# Altium schematic sheet 2.AD8220.SCHDOC
size A4
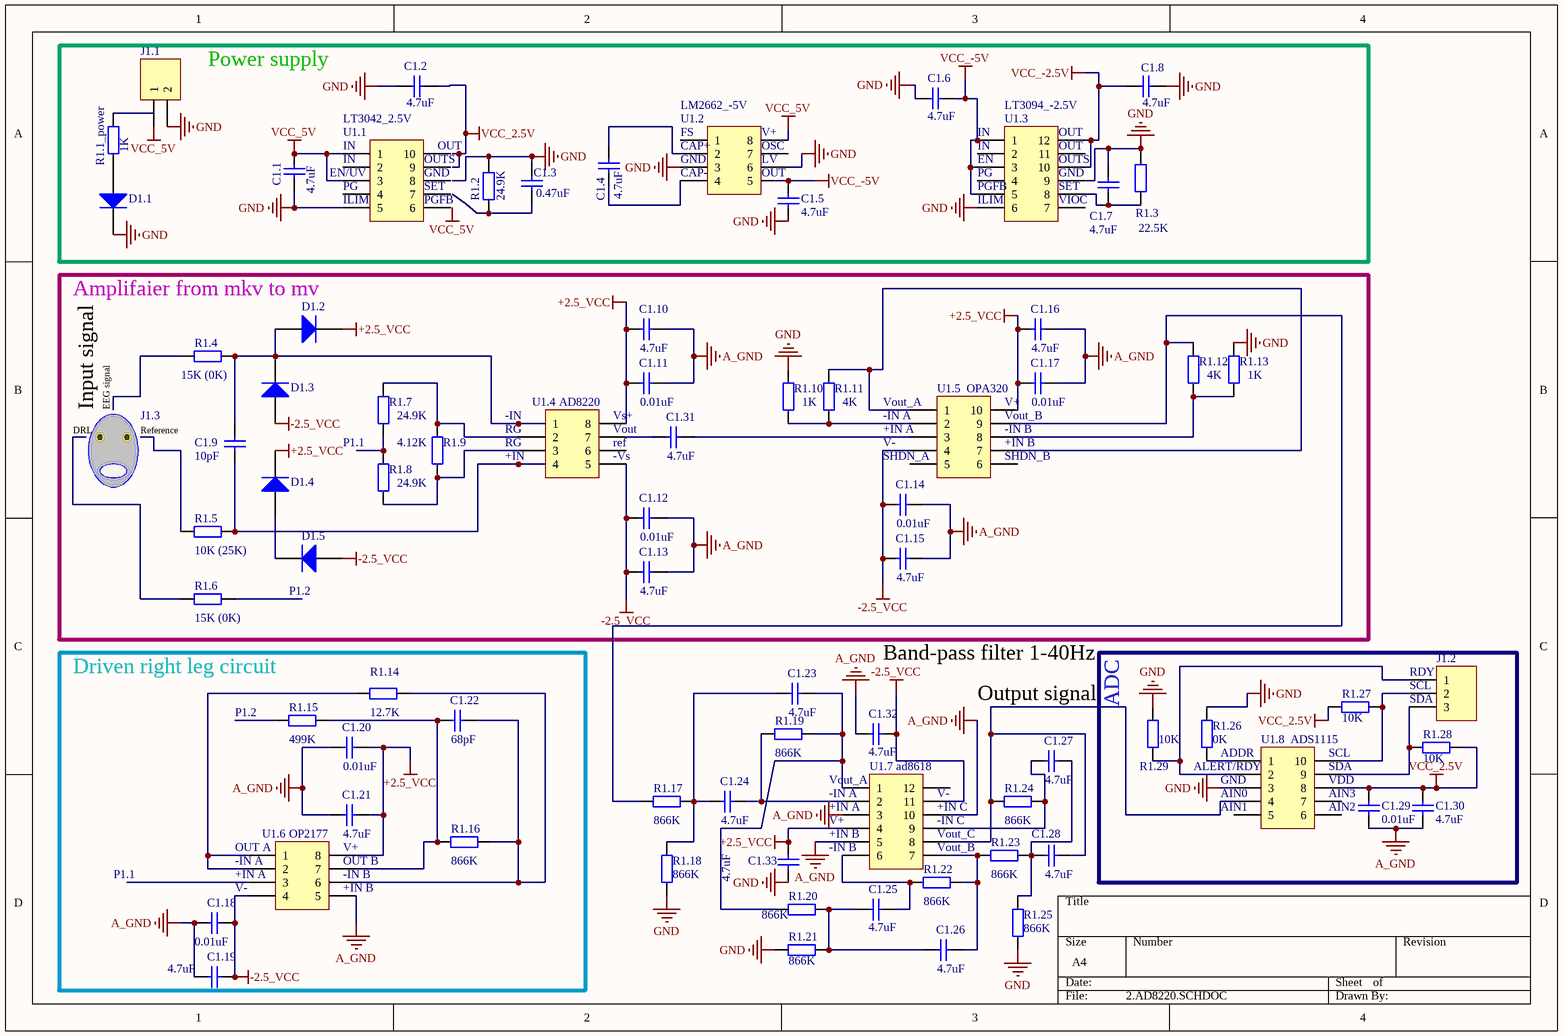
[diagram p0: 2.AD8220.SCHDOC]

## Parts
C1.1  4.7uF  [RAD-0.3]
C1.2  4.7uF  [RAD-0.3]
C1.3  0.47uF  [RAD-0.3]
C1.4  4.7uF  [RAD-0.3]
C1.5  4.7uF  [RAD-0.3]
C1.6  4.7uF  [RAD-0.3]
C1.7  4.7uF  [RAD-0.3]
C1.8  4.7uF  [RAD-0.3]
C1.9  value 10pF  [RAD-0.3]
C1.10  value 4.7uF  [RAD-0.3]
C1.11  value 0.01uF  [RAD-0.3]
C1.12  value 0.01uF  [RAD-0.3]
C1.13  value 4.7uF  [RAD-0.3]
C1.14  value 0.01uF  [RAD-0.3]
C1.15  value 4.7uF  [RAD-0.3]
C1.16  value 4.7uF  [RAD-0.3]
C1.17  value 0.01uF  [RAD-0.3]
C1.18  value 0.01uF  [RAD-0.3]
C1.19  value 4.7uF  [RAD-0.3]
C1.20  value 0.01uF  [RAD-0.3]
C1.21  value 4.7uF  [RAD-0.3]
C1.22  value 68pF  [RAD-0.3]
C1.23  value 4.7uF  [RAD-0.3]
C1.24  value 4.7uF  [RAD-0.3]
C1.25  value 4.7uF  [RAD-0.3]
C1.26  value 4.7uF  [RAD-0.3]
C1.27  value 4.7uF  [RAD-0.3]
C1.28  value 4.7uF  [RAD-0.3]
C1.29  value 0.01uF  [RAD-0.3]
C1.30  value 4.7uF  [RAD-0.3]
C1.31  value 4.7uF  [RAD-0.3]
C1.32  value 4.7uF  [RAD-0.3]
C1.33  value 4.7uF  [RAD-0.3]
D1.1  (no value)  [DO-35]
D1.2  (no value)  [DO-35]
D1.3  (no value)  [DO-35]
D1.4  (no value)  [DO-35]
D1.5  (no value)  [DO-35]
J1.1  (no value)  [HDR1X2]
J1.2  (no value)  [HDR1X3]
R1.1_power  1K  [AXIAL-0.4]
R1.2  24.9K  [AXIAL-0.4]
R1.3  22.5K  [AXIAL-0.4]
R1.4  value 15K (0K)  [AXIAL-0.4]
R1.5  value 10K (25K)  [AXIAL-0.4]
R1.6  value 15K (0K)  [AXIAL-0.4]
R1.7  value 24.9K  [AXIAL-0.4]
R1.8  value 24.9K  [AXIAL-0.4]
R1.9  value 4.12K  [AXIAL-0.4]
R1.10  value 1K  [AXIAL-0.4]
R1.11  value 4K  [AXIAL-0.4]
R1.12  value 4K  [AXIAL-0.4]
R1.13  value 1K  [AXIAL-0.4]
R1.14  value 12.7K  [AXIAL-0.4]
R1.15  value 499K  [AXIAL-0.4]
R1.16  value 866K  [AXIAL-0.4]
R1.17  value 866K  [AXIAL-0.4]
R1.18  value 866K  [AXIAL-0.4]
R1.19  value 866K  [AXIAL-0.4]
R1.20  value 866K  [AXIAL-0.4]
R1.21  value 866K  [AXIAL-0.4]
R1.22  value 866K  [AXIAL-0.4]
R1.23  value 866K  [AXIAL-0.4]
R1.24  value 866K  [AXIAL-0.4]
R1.25  value 866K  [AXIAL-0.4]
R1.26  value 0K  [AXIAL-0.4]
R1.27  value 10K  [AXIAL-0.4]
R1.28  value 10K  [AXIAL-0.4]
R1.29  value 10K  [AXIAL-0.4]
U1.1  (no value)  [MHDR2X5]
U1.2  (no value)  [MHDR2X4]
U1.3  (no value)  [MHDR2X6]
U1.4  AD8220  [MHDR2X4]
U1.5_OPA320  (no value)  [MHDR2X5]
U1.6  OP2177  [MHDR2X4]
U1.7_ad8618  (no value)  [MHDR2X6]
U1.8_ADS1115  (no value)  [MHDR2X5]

## Blocks framed on the sheet
Power supply: C1.1-C1.8 D1.1 J1.1 R1.1_power R1.2 R1.3 U1.1-U1.3
Driven right leg circuit: C1.18-C1.22 R1.14-R1.16 U1.6
ADC: C1.29 C1.30 J1.2 R1.26-R1.29 U1.8_ADS1115

## Nets
+2.5_VCC: C1.10.2 C1.11.2 C1.16.2 C1.17.2 C1.20.2 C1.21.2 C1.33.2 D1.2.2(K) D1.4.2(K) U1.4.8 U1.5_OPA320.10 U1.6.8 U1.7_ad8618.4
-2.5_VCC: C1.12.2 C1.13.2 C1.14.2 C1.15.2 C1.18.1 C1.19.1 C1.32.1 D1.3.1(A) D1.5.1(A) U1.4.5 U1.5_OPA320.4 U1.6.4 U1.7_ad8618.4(11)
A_GND: C1.10.1 C1.11.1 C1.12.1 C1.13.1 C1.14.1 C1.15.1 C1.16.1 C1.17.1 C1.18.2 C1.19.2 C1.20.1 C1.21.1 C1.29.2 C1.30.2 C1.32.2 U1.6.5 U1.7_ad8618.3 U1.7_ad8618.4(10) U1.7_ad8618.5
GND: C1.1.1 C1.2.1 C1.3.2 C1.5.1 C1.6.1 C1.7.2 C1.8.2 C1.33.1 D1.1.2(K) J1.1.2 R1.3.2 R1.10.2 R1.13.2 R1.18.1 R1.21.2 R1.25.1 R1.26.2 R1.29.2 U1.1.5 U1.2.3 U1.2.6 U1.3.7(6) U1.3.8(9) U1.8_ADS1115.3
VCC_2.5V: C1.2.2 C1.29.1 C1.30.1 R1.27.2 R1.28.1 U1.8_ADS1115.8
VCC_5V: C1.1.2 J1.1.1 U1.1.1 U1.1.3 U1.2.8
VCC_-2.5V: C1.8.1 U1.3.2(12) U1.3.4(11)
VCC_-5V: C1.5.2 C1.6.2 U1.2.5 U1.3.1 U1.3.3 U1.3.5
NetC1.3_1: C1.3.1 R1.2.1
NetC1.4_1: C1.4.1 U1.2.4
NetC1.4_2: C1.4.2 U1.2.2
NetC1.7_1: C1.7.1 R1.3.1 U1.3.8
NetC1.9_1: C1.9.1 R1.5.1 U1.4.4
NetC1.9_2: C1.9.2 D1.2.1(A) D1.3.2(K) R1.4.1 U1.4.1
NetC1.22_1: C1.22.1 R1.15.2 R1.16.1 U1.6.47(7)
NetC1.22_2: C1.22.2 R1.14.1 R1.16.2 U1.6.6
NetC1.23_1: C1.23.1 R1.19.2 R1.20.1 U1.7_ad8618.1
NetC1.23_2: C1.23.2 C1.24.2 R1.17.2 R1.18.2
NetC1.24_1: C1.24.1 R1.19.1 U1.7_ad8618.12(2)
NetC1.25_1: C1.25.1 C1.26.2 R1.20.2 R1.21.1
NetC1.25_2: C1.25.2 R1.22.1 U1.7_ad8618.7(6)
NetC1.26_1: C1.26.1 R1.22.2 R1.23.1 U1.7_ad8618.6(7)
NetC1.27_1: C1.27.1 C1.28.2 R1.23.2 R1.25.2
NetC1.27_2: C1.27.2 R1.24.2 U1.7_ad8618.8(9)
NetC1.28_1: C1.28.1 R1.24.1 U1.7_ad8618.8 U1.8_ADS1115.4
NetC1.31_1: C1.31.1 U1.5_OPA320.3
NetC1.31_2: C1.31.2 U1.4.47(7)
NetD1.1_1: D1.1.1(A) R1.1_power.1
NetD1.4_1: D1.4.1(A) D1.5.2(K)
NetJ1.2_1: J1.2.1 R1.29.1 U1.8_ADS1115.2
NetJ1.2_2: J1.2.2 R1.27.1 U1.8_ADS1115.10
NetJ1.2_3: J1.2.3 R1.28.2 U1.8_ADS1115.9
NetR1.7_1: R1.7.1 R1.8.2
NetR1.7_2: R1.7.2 R1.9.2 U1.4.2
NetR1.8_1: R1.8.1 R1.9.1 U1.4.3
NetR1.10_1: R1.10.1 R1.11.1 U1.5_OPA320.2
NetR1.11_2: R1.11.2 U1.5_OPA320.1 U1.5_OPA320.7
NetR1.12_1: R1.12.1 R1.13.1 U1.5_OPA320.8
NetR1.12_2: R1.12.2 R1.17.1 U1.5_OPA320.9
NetR1.14_2: R1.14.2 U1.6.1 U1.6.2
NetR1.26_1: R1.26.1 U1.8_ADS1115.1

Not connected (* = marked no-connect by the designer): R1.1_power 2; R1.2 2; R1.4 2; R1.5 2; R1.6 1 2; R1.15 1; U1.1 2 4 6 7 8 9 10; U1.2 1 47(7); U1.3 6(7) 12(2); U1.4 6; U1.5_OPA320 5 6; U1.6 3; U1.7_ad8618 2(12); U1.8_ADS1115 5 6 7

## Notes on the sheet
- (near U1.2) LM2662_-5V
- (near U1.3) LT3094_-2.5V
- (near U1.1) EN/UV
- LT3042_2.5V
- (near U1.1) IN
- (near U1.1) OUTS
- (near U1.1) GND
- (near U1.1) OUT
- (near U1.2) FS
- (near U1.2) CAP+
- (near U1.2) GND
- (near U1.2) CAP-
- (near U1.2) V+
- (near U1.2) OSC
- (near U1.2) LV
- (near U1.2) OUT
- (near U1.3) IN
- (near U1.3) EN
- (near U1.3) PG
- (near U1.3) OUT
- (near U1.3) OUTS
- (near U1.3) GND
- (near U1.1) PG
- (near U1.1) ILIM
- (near U1.1) SET
- (near U1.1) PGFB
- (near U1.3) PGFB
- (near U1.3) ILIM
- (near U1.3) SET
- (near U1.3) VIOC
- (near D1.2) Amplifaier from mkv to mv
- DRL
- Input signal
- EEG signal
- Reference
- J1.3
- P1.1
- (near U1.4) -IN
- (near U1.4) RG
- (near U1.4) Vout
- (near U1.4) ref
- (near U1.4) Vs+
- (near U1.5_OPA320) Vout_A
- (near U1.5_OPA320) -IN A
- (near U1.5_OPA320) +IN A
- V-
- V+
- (near U1.5_OPA320) Vout_B
- (near U1.5_OPA320) -IN B
- (near U1.5_OPA320) +IN B
- (near U1.4) +IN
- (near U1.4) -Vs
- (near U1.5_OPA320) SHDN_A
- (near U1.5_OPA320) SHDN_B
- (near D1.5) P1.2
- (near R1.15) P1.2
- Band-pass filter 1-40Hz
- Output signal
- (near J1.2) RDY
- (near J1.2) SCL
- (near J1.2) SDA
- (near U1.7_ad8618) Vout_A
- ALERT/RDY
- ADDR
- GND
- (near U1.8_ADS1115) VDD
- (near U1.8_ADS1115) SDA
- (near U1.8_ADS1115) SCL
- (near U1.6) OUT A
- (near U1.6) V+
- (near U1.7_ad8618) -IN A
- (near U1.7_ad8618) +IN A
- (near U1.7_ad8618) V+
- (near U1.7_ad8618) +IN B
- (near U1.7_ad8618) -IN B
- Vout_B
- Vout_C
- (near U1.7_ad8618) -IN C
- (near U1.7_ad8618) +IN C
- (near U1.7_ad8618) V-
- (near U1.8_ADS1115) AIN0
- (near U1.8_ADS1115) AIN1
- AIN2
- AIN3
- (near U1.6) -IN A
- (near U1.6) +IN A
- (near U1.6) OUT B
- (near U1.6) -IN B
- (near U1.6) +IN B
- Labels drawn without touching a wire or pin: VCC_5V

## Library data of the parts
C1.1-C1.33 = Cap: Capacitor; Published: 8-Jun-2000; LatestRevisionDate: 17-Jul-2002; LatestRevisionNote: Re-released for DXP Platform.; PackageReference: RAD-0.3; Publisher: Altium Limited
D1.1-D1.5 = Diode 1N914: High Conductance Fast Diode; Published: 8-Jun-2000; LatestRevisionDate: 17-Jul-2002; LatestRevisionNote: Re-released for DXP Platform.; DatasheetDocument: 1997; PackageReference: DO-35; Publisher: Altium Limited; Code_JEDEC: DO-204-AH; ComponentLink1Description: Manufacturer Link; ComponentLink1URL: http://www.fairchildsemi.com/; ComponentLink2Description: Datasheet; ComponentLink2URL: http://www.fairchildsemi.com/ds/1N%2F1N4448.pdf
J1.1 = Header 2: Header, 2-Pin; LatestRevisionDate: 17-Jul-2002; LatestRevisionNote: Re-released for DXP Platform.; Publisher: Altium Limited
J1.2 = Header 3: Header, 3-Pin; LatestRevisionDate: 17-Jul-2002; LatestRevisionNote: Re-released for DXP Platform.; Publisher: Altium Limited
R1.1_power R1.2-R1.29 = Res2: Resistor; Published: 8-Jun-2000; LatestRevisionDate: 17-Jul-2002; LatestRevisionNote: Re-released for DXP Platform.; PackageReference: AXIAL-0.4; Publisher: Altium Limited
U1.1 U1.5_OPA320 U1.8_ADS1115 = MHDR2X5: Header, 5-Pin, Dual row; LatestRevisionDate: 17-Jul-2002; Publisher: Altium Limited
U1.2 U1.4 U1.6 = MHDR2X4: Header, 4-Pin, Dual row; LatestRevisionDate: 17-Jul-2002; LatestRevisionNote: Re-released for DXP Platform.; Publisher: Altium Limited
U1.3 U1.7_ad8618 = MHDR2X6: Header, 6-Pin, Dual row; LatestRevisionDate: 17-Jul-2002; LatestRevisionNote: Re-released for DXP Platform.; Publisher: Altium Limited